# EAGLE design M715 (EAGLE 6.6.0)
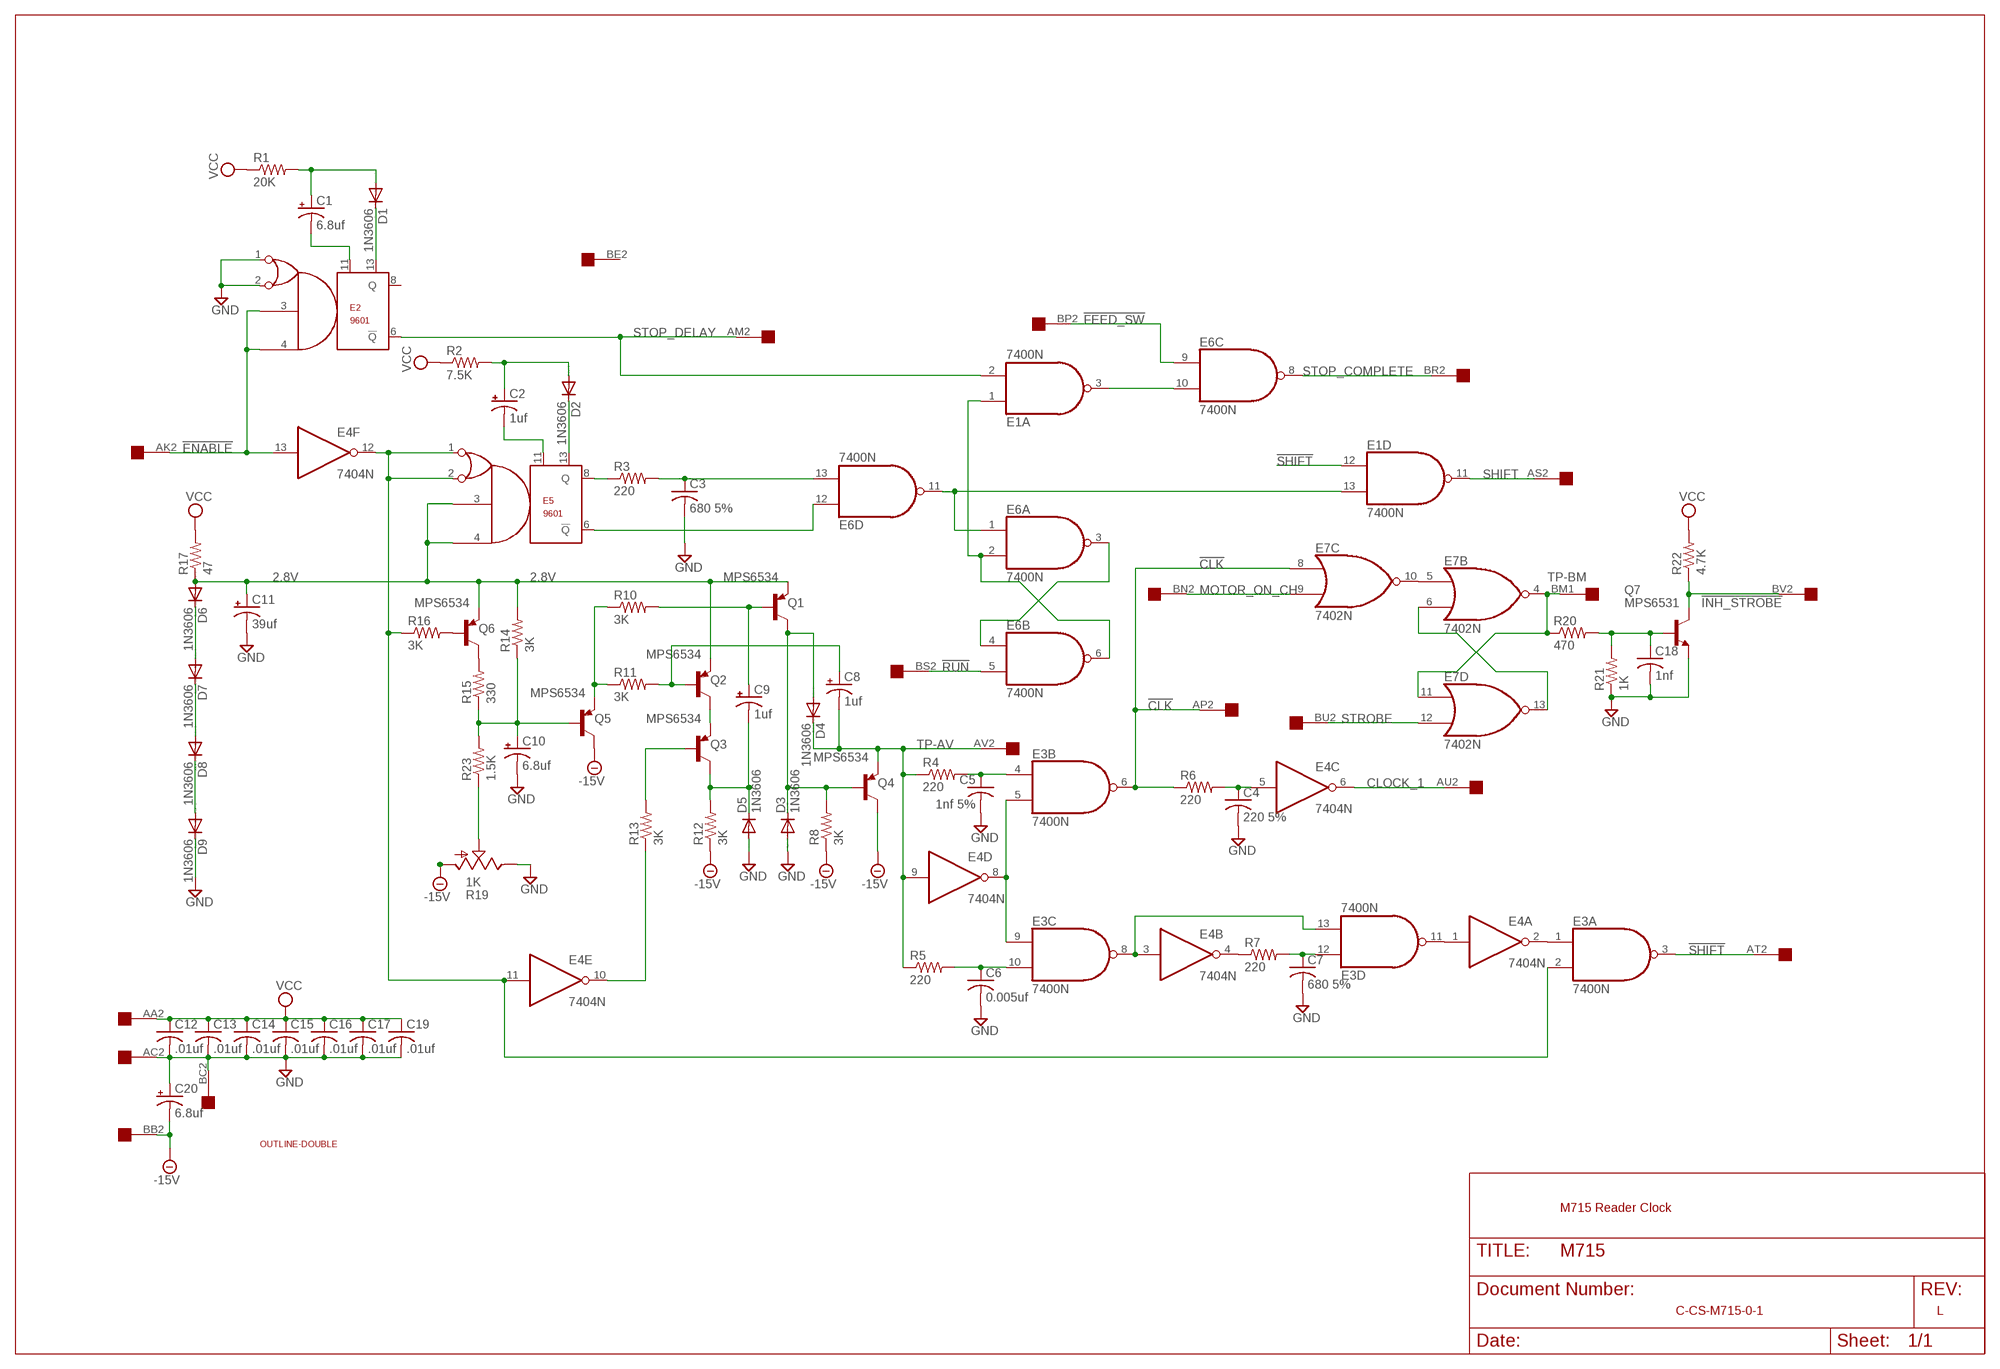
[diagram p0: schematic, sheet 1]

## Parts
C1  6.8uf  CPOL-USE22-6AXIAL  [E22-6]
C2  1uf  CPOL-USE15-5AXIAL  [E15-5]
C3  680 5%  C-US050-025X075  [C050-025X075]
C4  220 5%  C-US050-025X075  [C050-025X075]
C5  1nf 5%  C-US050-025X075  [C050-025X075]
C6  0.005uf  C-US050-025X075  [C050-025X075]
C7  680 5%  C-US050-025X075  [C050-025X075]
C8  1uf  CPOL-USE15-5AXIAL  [E15-5]
C9  1uf  CPOL-USE15-5AXIAL  [E15-5]
C10  6.8uf  CPOL-USE22-6AXIAL  [E22-6]
C11  39uf  CPOL-USE22-6AXIAL  [E22-6]
C12  .01uf  C-US050-025X075  [C050-025X075]
C13  .01uf  C-US050-025X075  [C050-025X075]
C14  .01uf  C-US050-025X075  [C050-025X075]
C15  .01uf  C-US050-025X075  [C050-025X075]
C16  .01uf  C-US050-025X075  [C050-025X075]
C17  .01uf  C-US050-025X075  [C050-025X075]
C18  1nf  C-US050-025X075  [C050-025X075]
C19  .01uf  C-US050-025X075  [C050-025X075]
C20  6.8uf  CPOL-USE22-6AXIAL  [E22-6]
D1  1N3606  1N4148DO35-10  [DO35-10]
D2  1N3606  1N4148DO35-10  [DO35-10]
D3  1N3606  1N4148DO35-10  [DO35-10]
D4  1N3606  1N4148DO35-10  [DO35-10]
D5  1N3606  1N4148DO35-10  [DO35-10]
D6  1N3606  1N4148DO35-10  [DO35-10]
D7  1N3606  1N4148DO35-10  [DO35-10]
D8  1N3606  1N4148DO35-10  [DO35-10]
D9  1N3606  1N4148DO35-10  [DO35-10]
E1  7400N  [DIL14]
E2  9601  [DIL14]
E3  7400N  [DIL14]
E4  7404N  [DIL14]
E5  9601  [DIL14]
E6  7400N  [DIL14]
E7  7402N  [DIL14]
Q1  MPS6534  -PNP-TO92  [TO92]
Q2  MPS6534  -PNP-TO92  [TO92]
Q3  MPS6534  -PNP-TO92  [TO92]
Q4  MPS6534  -PNP-TO92  [TO92]
Q5  MPS6534  -PNP-TO92  [TO92]
Q6  MPS6534  -PNP-TO92  [TO92]
Q7  MPS6531  -NPN-TO92  [TO92]
R1  20K  R-US_0207/10  [0207/10]
R2  7.5K  R-US_0207/10  [0207/10]
R3  220  R-US_0207/10  [0207/10]
R4  220  R-US_0207/10  [0207/10]
R5  220  R-US_0207/10  [0207/10]
R6  220  R-US_0207/10  [0207/10]
R7  220  R-US_0207/10  [0207/10]
R8  3K  R-US_0207/10  [0207/10]
R10  3K  R-US_0207/10  [0207/10]
R11  3K  R-US_0207/10  [0207/10]
R12  3K  R-US_0207/10  [0207/10]
R13  3K  R-US_0207/10  [0207/10]
R14  3K  R-US_0207/10  [0207/10]
R15  330  R-US_0207/10  [0207/10]
R16  3K  R-US_0207/10  [0207/10]
R17  47  R-US_0207/10  [0207/10]
R19  1K  TRIM_US-PTSPIN  [PT-SPIN]
R20  470  R-US_0207/10  [0207/10]
R21  1K  R-US_0207/10  [0207/10]
R22  4.7K  R-US_0207/10  [0207/10]
R23  1.5K  R-US_0207/10  [0207/10]
U$1  DOUBLE  [EDGE-CON4]
U$2  OUTLINE-DOUBLE  [DOUBLE]

## Nets
2.8V: C11.+ D6.A E5.3 E5.4 Q1.1(E) Q2.1(E) Q6.1(E) R14.2 R17.1
!CLK: E3.6(B:O) E7.8(C:I0) R6.1 U$1.AP2
!ENABLE: E2.3 E2.4 E4.13(F:I) U$1.AK2
!FEED_SW: E6.9(C:I0) U$1.BP2
!INH_STROBE: Q7.3(C) R22.1 U$1.BV2
!RUN: E6.5(B:I1) U$1.BS2
!SHIFT: E1.12(D:I0) E3.3(A:O) U$1.AT2
-15V: C20.- Q4.3(C) Q5.3(C) R8.1 R12.1 R19.A U$1.BB2
CLOCK_1: E4.6(C:O) U$1.AU2
GND: C3.2 C4.2 C5.2 C6.2 C7.2 C10.- C11.- C12.2 C13.2 C14.2 C15.2 C16.2 C17.2 C18.2 C19.2 C20.+ D3.A D5.A D9.C E2.1 E2.2 Q7.1(E) R19.E R21.1 U$1.AC2 U$1.BC2
MOTOR_ON_CH: E7.9(C:I1) U$1.BN2
N$1: E6.3(A:O) E6.4(B:I0)
N$2: E1.1(A:I0) E6.2(A:I1) E6.6(B:O)
N$3: E1.13(D:I1) E6.1(A:I0) E6.11(D:O)
N$4: E3.1(A:I0) E4.2(A:O)
N$5: E7.6(B:I1) E7.13(D:O)
N$6: E1.3(A:O) E6.10(C:I1)
N$7: Q6.2(B) R16.2
N$8: E7.5(B:I0) E7.10(C:O)
N$9: E3.2(A:I1) E4.11(E:I) E4.12(F:O) E5.1 E5.2 R16.1
N$10: E3.5(B:I1) E3.9(C:I0) E4.8(D:O)
N$11: E3.11(D:O) E4.1(A:I)
N$12: E3.8(C:O) E3.13(D:I1) E4.3(B:I)
N$13: C7.1 E3.12(D:I0) R7.2
N$14: E4.4(B:O) R7.1
N$15: R19.S R23.1
N$16: C4.1 E4.5(C:I) R6.2
N$17: C18.1 Q7.2(B) R20.2 R21.2
N$18: C6.1 E3.10(C:I1) R5.2
N$19: C5.1 E3.4(B:I0) R4.2
N$20: D6.C D7.A
N$21: D7.C D8.A
N$22: D8.C D9.A
N$23: Q6.3(C) R15.2
N$24: C10.+ Q5.2(B) R14.1 R15.1 R23.2
N$26: Q5.1(E) R10.1 R11.1
N$27: Q2.3(C) Q3.1(E)
N$28: C8.+ Q2.2(B) R11.2
N$29: E4.10(E:O) R13.1
N$30: Q3.2(B) R13.2
N$31: C9.- D5.C Q3.3(C) R12.2
N$32: C9.+ Q1.2(B) R10.2
N$33: D3.C D4.A Q1.3(C) Q4.2(B) R8.2
N$35: D1.C E2.13
N$36: C1.- E2.11
N$37: C1.+ D1.A R1.2
N$38: D2.C E5.13
N$39: C2.- E5.11
N$40: C2.+ D2.A R2.2
N$41: E5.6(!Q) E6.12(D:I0)
N$42: E5.8(Q) R3.1
N$43: C3.1 E6.13(D:I1) R3.2
SHIFT: E1.11(D:O) U$1.AS2
STOP_COMPLETE: E6.8(C:O) U$1.BR2
STOP_DELAY: E1.2(A:I1) E2.6(!Q) U$1.AM2
STROBE: E7.12(D:I1) U$1.BU2
TP-AV: C8.- D4.C E4.9(D:I) Q4.1(E) R4.1 R5.1 U$1.AV2
TP-BM: E7.4(B:O) E7.11(D:I0) R20.1 U$1.BM1
VCC: C12.1 C13.1 C14.1 C15.1 C16.1 C17.1 C19.1 R1.1 R2.1 R17.2 R22.2 U$1.AA2
Unconnected: E1.4(B:I0) E1.5(B:I1) E1.6(B:O) E1.8(C:O) E1.9(C:I0) E1.10(C:I1) E2.8(Q) E7.1(A:O) E7.2(A:I0) E7.3(A:I1) U$1.AA1 U$1.AB1 U$1.AB2 U$1.AC1 U$1.AD1 U$1.AD2 U$1.AE1 U$1.AE2 U$1.AF1 U$1.AF2 U$1.AH1 U$1.AH2 U$1.AJ1 U$1.AJ2 U$1.AK1 U$1.AL1 U$1.AL2 U$1.AM1 U$1.AN1 U$1.AN2 U$1.AP1 U$1.AR1 U$1.AR2 U$1.AS1 U$1.AT1 U$1.AU1 U$1.AV1 U$1.BA1 U$1.BA2 U$1.BB1 U$1.BC1 U$1.BD1 U$1.BD2 U$1.BE1 U$1.BE2 U$1.BF1 U$1.BF2 U$1.BH1 U$1.BH2 U$1.BJ1 U$1.BJ2 U$1.BK1 U$1.BK2 U$1.BL1 U$1.BL2 U$1.BM2 U$1.BN1 U$1.BP1 U$1.BR1 U$1.BS1 U$1.BT1 U$1.BT2 U$1.BU1 U$1.BV1

## Notes on the sheet
- M715 Reader Clock
- C-CS-M715-0-1 | L

## Power pins joined to a net without a drawn wire
GND: E1.7(P:GND) E2.7(GND) E3.7(P:GND) E4.7(P:GND) E5.7(GND) E6.7(P:GND) E7.7(P:GND)
VCC: E1.14(P:VCC) E2.14(VCC) E3.14(P:VCC) E4.14(P:VCC) E5.14(VCC) E6.14(P:VCC) E7.14(P:VCC)

## Library data of the parts
C1 C2 C8-C11 C20 = rcl:CPOL-US: POLARIZED CAPACITOR, American symbol
C3-C7 C12-C19 = rcl:C-US: CAPACITOR, American symbol
D1-D9 = diode:1N4148: DIODE high speed (Philips)
E1 E3 E6 = 74xx-us:74*00: Quad 2-input NAND gate
E2 E5 = dec-con:9601: DEC9601 monstable
E4 = 74xx-us:74*04: Hex INVERTER
E7 = 74xx-us:74*02: Quad 2-input NOR gate
Q1-Q6 = transistor:*-PNP-: PNP Transistror
Q7 = transistor:*-NPN-: NPN Transistror BF959 corrected 2008.03.06
R1-R8 R10-R17 R20-R23 = rcl:R-US_: RESISTOR, American symbol
R19 = pot:TRIM_US-: POTENTIOMETER
U$1 = dec-con:DOUBLE: Double-Height DEC board
U$2 = dec-con:OUTLINE-*: Board outlines for DEC boards.

## Board
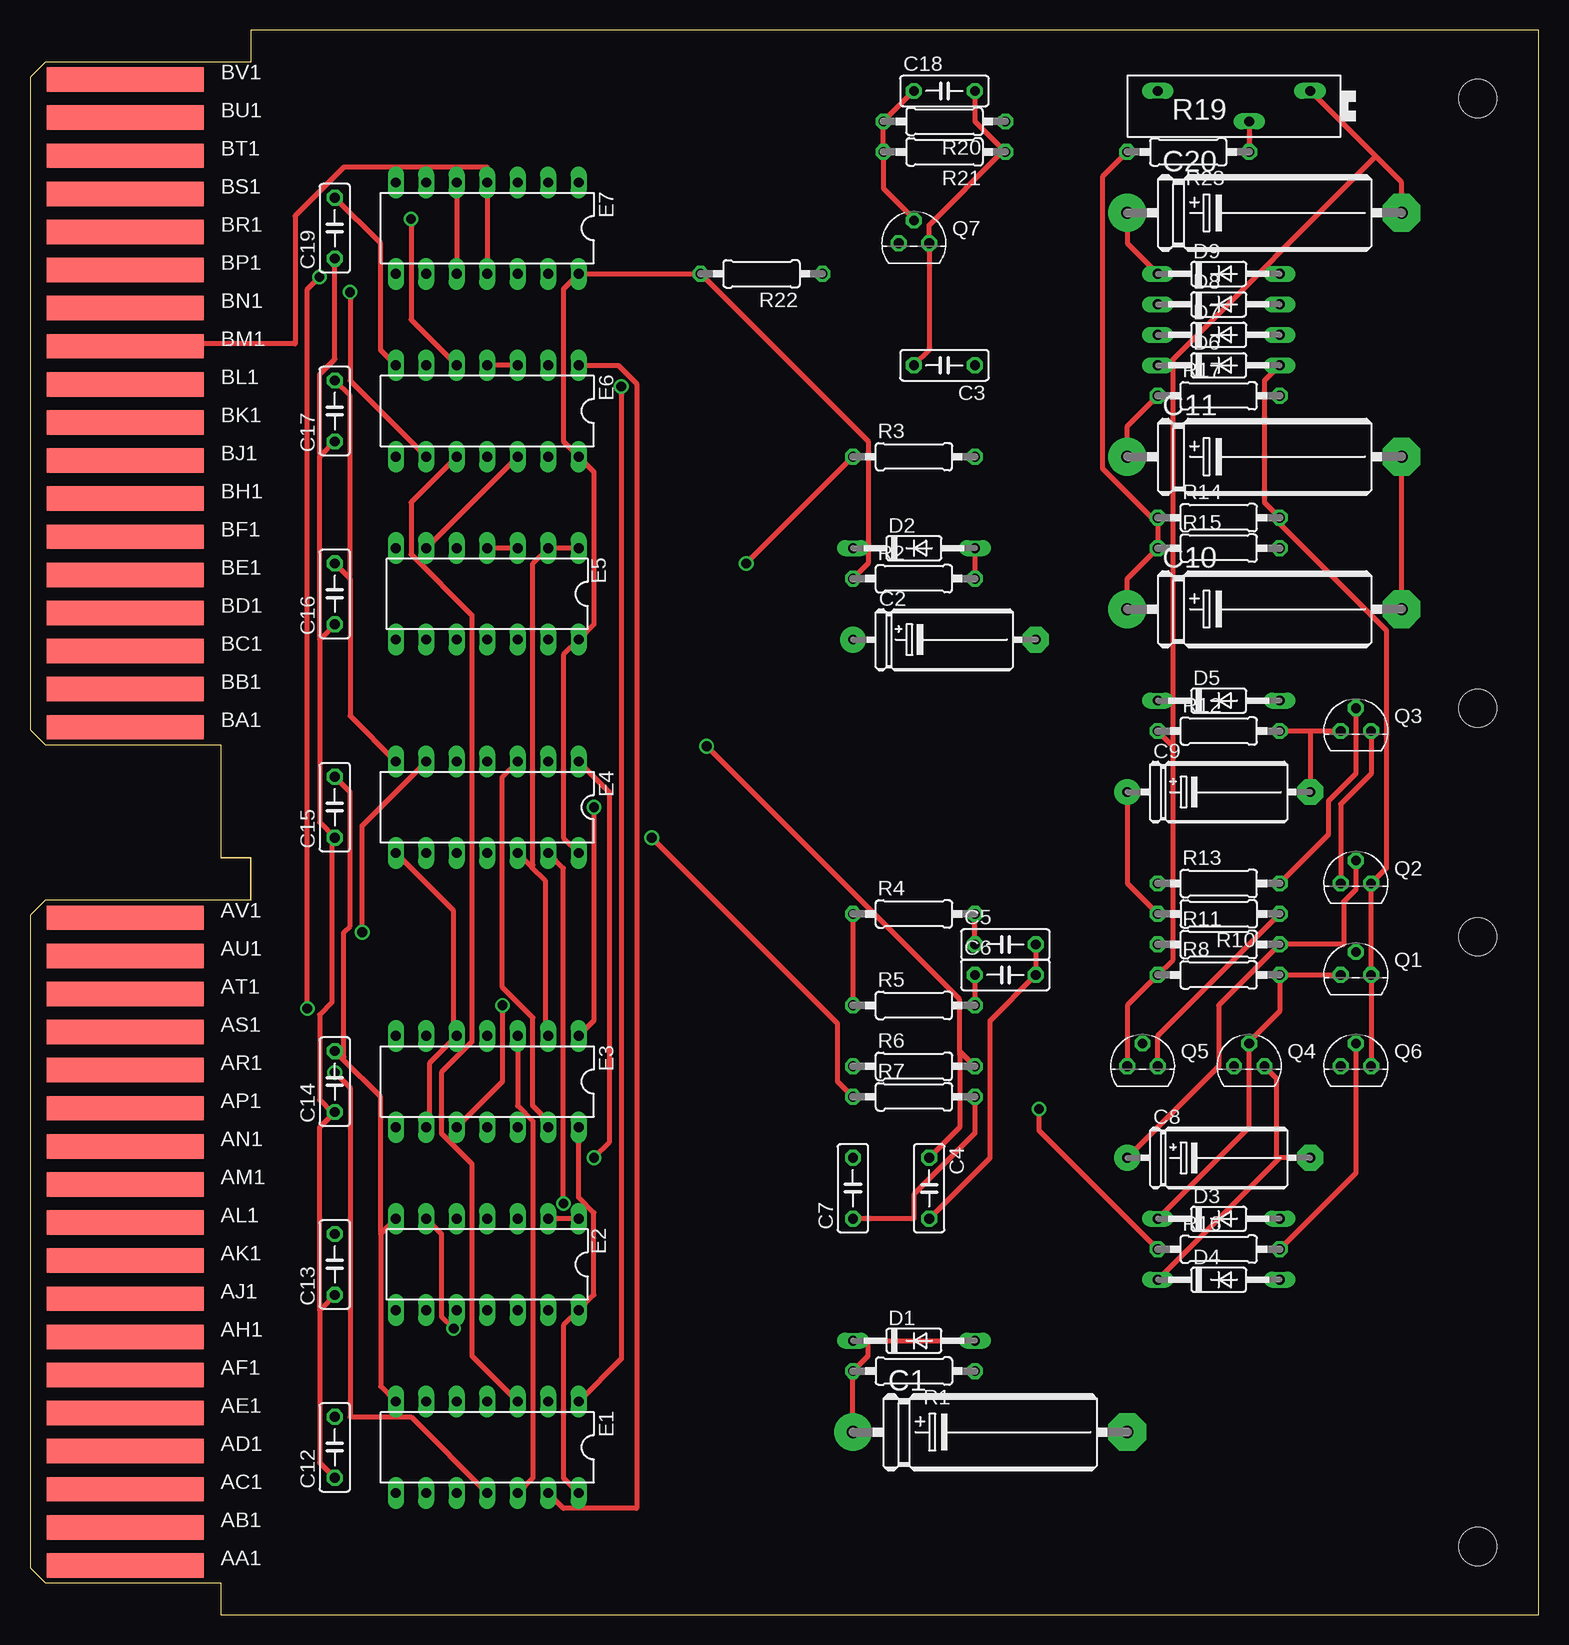
[diagram p1: board, top side]
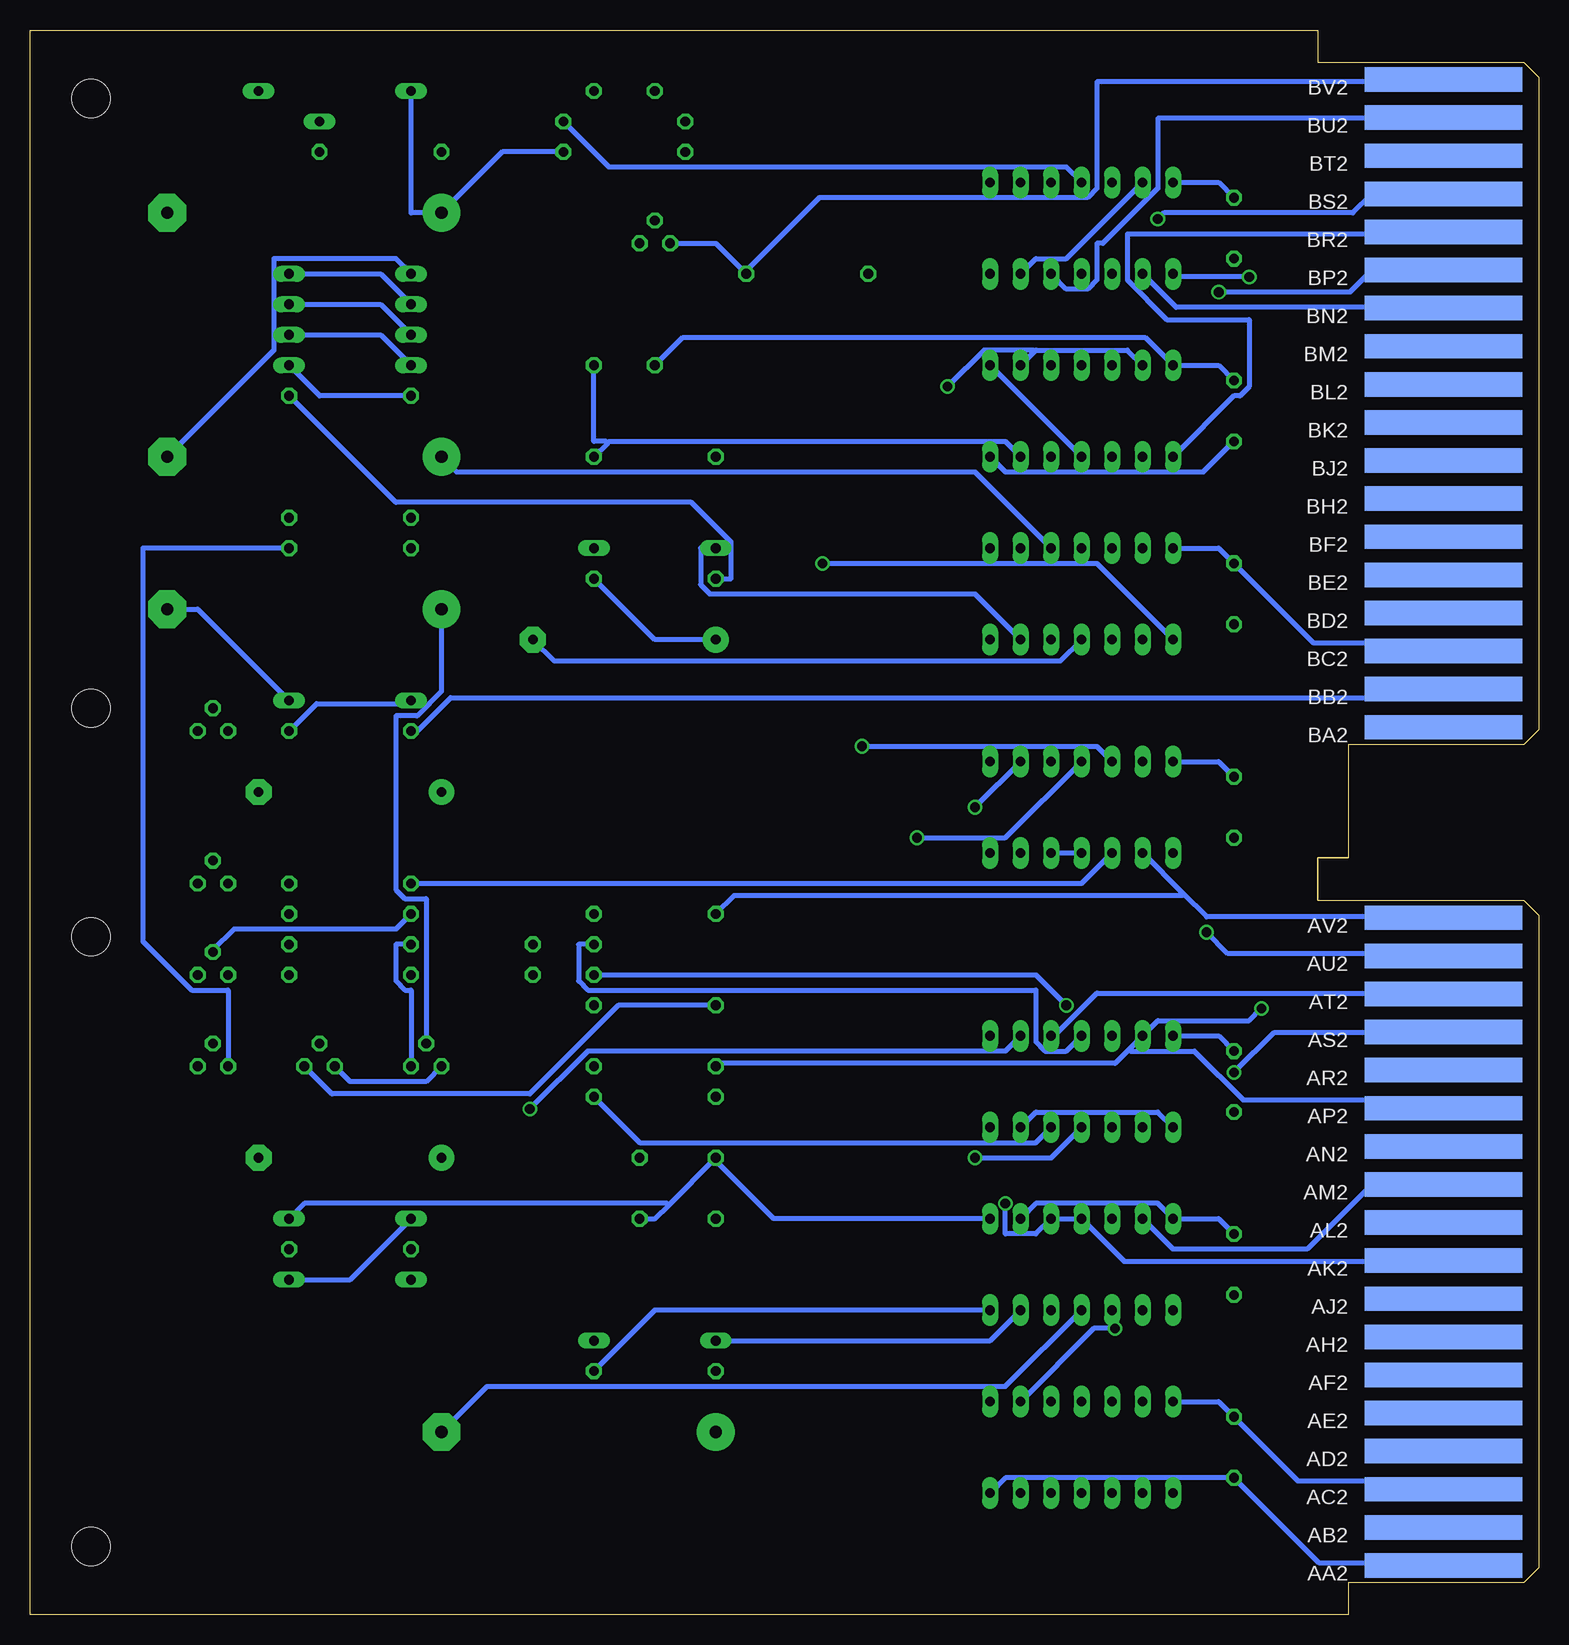
[diagram p2: board, bottom side, seen from below]

Size 125.73 x 132.08 mm. Coordinates in mm from the lower left corner, seen from the top.
Copper layers (1+16): Top 0.035mm / dielectric 1.5mm / Bottom 0.035mm
Design rules "16mils": minimum track width 16mil, minimum drill 32mil, track to track 15mil, track to pad 10mil, pad to pad 10mil, via to via 10mil, smd to smd 10mil, copper to edge 13mil, drill to drill 10mil, minimum pad ring 10mil, minimum via ring 8mil, stop-mask expansion 0mil, vias tented up to drill 0mil, thermal gap 10mil

### Footprints (pad centres in the part's own frame; a part is rotated, then mirrored left to right if it is on the bottom)
E22-6 = drill 1.016 pad 3.15: + -11.43,0 | drill 1.016 pad 3.15 octagon: - 11.43,0
E15-5 = drill 0.813 pad 2.159: + -7.62,0 | drill 0.813 pad 2.159 octagon: - 7.62,0
C050-025X075 = drill 0.813 octagon: 1 -2.54,0; 2 2.54,0
DO35-10 = drill 0.813 long: A 5.08,0; C -5.08,0
DIL14 = drill 0.813 long: 1 -7.62,-3.81; 2 -5.08,-3.81; 3 -2.54,-3.81; 4 0,-3.81; 5 2.54,-3.81; 6 5.08,-3.81; 7 7.62,-3.81; 8 7.62,3.81; 9 5.08,3.81; 10 2.54,3.81; 11 0,3.81; 12 -2.54,3.81; 13 -5.08,3.81; 14 -7.62,3.81
TO92 = drill 0.813 octagon: 1 1.27,0; 2 0,1.905; 3 -1.27,0
0207/10 = drill 0.813 octagon: 1 -5.08,0; 2 5.08,0
PT-SPIN = drill 0.813 long: A -6.35,-1.27; E 6.35,-1.27; S -1.27,1.27
EDGE-CON4 = smd 13.106 x 2.032: AA1 7.938,4.128; AB1 7.938,7.303; AC1 7.938,10.477; AD1 7.938,13.652; AE1 7.938,16.828; AF1 7.938,20.003; AH1 7.938,23.177; AJ1 7.938,26.352; AK1 7.938,29.527; AL1 7.938,32.703; AM1 7.938,35.877; AN1 7.938,39.053; AP1 7.938,42.227; AR1 7.938,45.403; AS1 7.938,48.578; AT1 7.938,51.752; AU1 7.938,54.928; AV1 7.938,58.102; BA1 7.938,73.978; BB1 7.938,77.153; BC1 7.938,80.328; BD1 7.938,83.502; BE1 7.938,86.677; BF1 7.938,89.853; BH1 7.938,93.028; BJ1 7.938,96.203; BK1 7.938,99.377; BL1 7.938,102.552; BM1 7.938,105.728; BN1 7.938,108.903; BP1 7.938,112.078; BR1 7.938,115.252; BS1 7.938,118.427; BT1 7.938,121.603; BU1 7.938,124.778; BV1 7.938,127.953 | smd 13.106 x 2.032 bottom: AA2 7.938,4.128; AB2 7.938,7.303; AC2 7.938,10.477; AD2 7.938,13.652; AE2 7.938,16.828; AF2 7.938,20.003; AH2 7.938,23.177; AJ2 7.938,26.352; AK2 7.938,29.527; AL2 7.938,32.703; AM2 7.938,35.877; AN2 7.938,39.053; AP2 7.938,42.227; AR2 7.938,45.403; AS2 7.938,48.578; AT2 7.938,51.752; AU2 7.938,54.928; AV2 7.938,58.102; BA2 7.938,73.978; BB2 7.938,77.153; BC2 7.938,80.328; BD2 7.938,83.502; BE2 7.938,86.677; BF2 7.938,89.853; BH2 7.938,93.028; BJ2 7.938,96.203; BK2 7.938,99.377; BL2 7.938,102.552; BM2 7.938,105.728; BN2 7.938,108.903; BP2 7.938,112.078; BR2 7.938,115.252; BS2 7.938,118.427; BT2 7.938,121.603; BU2 7.938,124.778; BV2 7.938,127.953
DOUBLE = hole 3.175: 120.65,56.515; 120.65,5.715; 120.65,75.565; 120.65,126.365

### Placement (x,y rotation side)
C1  80.01,15.24 0 top
C2  76.2,81.28 0 top
C3  76.2,104.14 180 top
C4  74.93,35.56 270 top
C5  81.28,55.88 0 top
C6  81.28,53.34 0 top
C7  68.58,35.56 90 top
C8  99.06,38.1 0 top
C9  99.06,68.58 0 top
C10  102.87,83.82 0 top
C11  102.87,96.52 0 top
C12  25.4,13.97 90 top
C13  25.4,29.21 90 top
C14  25.4,44.45 90 top
C15  25.4,67.31 90 top
C16  25.4,85.09 90 top
C17  25.4,100.33 90 top
C18  76.2,127 0 top
C19  25.4,115.57 90 top
C20  102.87,116.84 0 top
D1  73.66,22.86 0 top
D2  73.66,88.9 0 top
D3  99.06,33.02 0 top
D4  99.06,27.94 0 top
D5  99.06,76.2 0 top
D6  99.06,104.14 0 top
D7  99.06,106.68 0 top
D8  99.06,109.22 0 top
D9  99.06,111.76 0 top
E1  38.1,13.97 180 top
E2  38.1,29.21 180 top
E3  38.1,44.45 180 top
E4  38.1,67.31 180 top
E5  38.1,85.09 180 top
E6  38.1,100.33 180 top
E7  38.1,115.57 180 top
Q1  110.49,53.34 0 top
Q2  110.49,60.96 0 top
Q3  110.49,73.66 0 top
Q4  101.6,45.72 0 top
Q5  92.71,45.72 0 top
Q6  110.49,45.72 0 top
Q7  73.66,114.3 0 top
R1  73.66,20.32 180 top
R2  73.66,86.36 0 top
R3  73.66,96.52 0 top
R4  73.66,58.42 0 top
R5  73.66,50.8 0 top
R6  73.66,45.72 0 top
R7  73.66,43.18 0 top
R8  99.06,53.34 0 top
R10  99.06,58.42 180 top
R11  99.06,55.88 0 top
R12  99.06,73.66 0 top
R13  99.06,60.96 0 top
R14  99.06,91.44 0 top
R15  99.06,88.9 0 top
R16  99.06,30.48 0 top
R17  99.06,101.6 0 top
R19  100.33,125.73 180 top
R20  76.2,124.46 180 top
R21  76.2,121.92 180 top
R22  60.96,111.76 180 top
R23  96.52,121.92 180 top
U$1  0,0 0 top
U$2  0,0 0 top

### Tracks (layer width: path | path; a pad name or v marks a point on that pad's centre or on a via)
2.8V
  Top 0.406: Q6.1 Q1.1 Q2.1 113.03,62.23 113.03,82.04 104.14,90.93 R14.2 102.87,92.71 102.87,102.87 D6.A | E5.3 E5.4 | R17.1 91.44,99.06 C11.+
  Bottom 0.406: E5.3 46.99,95.25 90.17,95.25 C11.+ | D6.A 101.6,101.6 R17.1
!CLK  (via drill 0.81)
  Top 0.406: v24.13,111.51 23.11,110.49 v23.11,50.55
  Bottom 0.406: R6.1 68.33,45.97 35.31,45.97 34.16,47.12 | 34.16,47.12 E3.6 31.75,49.53 24.13,49.53 v23.11,50.55 | E7.8 30.23,111.51 v24.13,111.51 | U$1.AP2 8.64,42.93 24.64,42.93 28.7,46.99 34.04,46.99 34.16,47.12
!ENABLE  (via drill 0.81)
  Top 0.406: E4.13 44.45,62.23 v44.45,34.29
  Bottom 0.406: v44.45,34.29 44.45,31.75 41.91,31.75 E2.3 E2.4 34.54,29.46 8.13,29.46 U$1.AK2
!FEED_SW  (via drill 0.81)
  Top 0.406: E6.9 26.67,102.87 v26.67,110.24
  Bottom 0.406: v26.67,110.24 15.75,110.24 13.97,112.01 8.13,112.01 U$1.BP2
!INH_STROBE
  Bottom 0.406: Q7.3 68.58,114.3 R22.1 66.04,112.01 59.94,118.11 37.59,118.11 36.83,118.87 36.83,127.76 8.13,127.76 U$1.BV2
!RUN  (via drill 0.81)
  Top 0.406: E6.5 31.75,107.95 v31.75,116.33
  Bottom 0.406: v31.75,116.33 31.24,116.84 15.49,116.84 13.97,118.36 8.13,118.36 U$1.BS2
!SHIFT
  Top 0.406: E1.12 41.91,11.43 41.91,41.15 40.64,42.42 E3.3
  Bottom 0.406: E3.3 40.39,48.26 36.83,51.82 8.13,51.82 U$1.AT2
-15V
  Top 0.406: 112.14,121.54 114.3,119.38 C20.- | 112.14,121.54 R19.A | Q5.3 91.44,50.8 R8.1 95.25,54.61 95.25,72.39 95.12,72.52 | 95.12,72.52 R12.1 | 112.14,121.54 95.25,104.65 95.25,72.64 95.12,72.52
  Bottom 0.406: Q4.3 99.06,44.45 92.71,44.45 Q5.3 | U$1.BB2 8.64,76.45 90.68,76.45 93.47,73.66 R12.1
CLOCK_1  (via drill 0.81)
  Top 0.406: E4.6 27.69,65.79 v27.69,56.9
  Bottom 0.406: v27.69,56.9 25.91,55.12 8.13,55.12 U$1.AU2
GND
  Top 0.406: C10.- C11.- | D9.C 91.44,114.3 C20.+ | C18.2 78.74,124.46 R21.1 81.03,121.92 74.93,115.82 Q7.1 74.93,105.41 C3.2 | E4.7 26.67,74.93 26.67,86.36 26.54,86.49 | C16.2 26.54,86.49 | C17.2 26.67,101.6 26.67,86.61 26.54,86.49 | C19.2 29.21,114.3 29.21,105.41 E6.7 | C5.2 C6.2 80.01,49.53 80.01,38.1 C4.2 | E2.1 E2.2 | E1.7 29.21,19.05 29.21,31.75 29.34,31.88 | E2.7 29.34,31.88 | 26.04,46.35 29.21,43.18 29.21,32 29.34,31.88 | 26.04,46.35 C14.2 | C15.2 26.67,68.58 26.67,57.4 26.16,56.9 26.16,46.48 26.04,46.35
  Bottom 0.406: D5.A 111.76,83.82 C10.- | R19.E 93.98,116.84 C20.+ 86.36,121.92 R21.1 | C11.- 105.41,105.41 105.41,113.03 95.25,113.03 D9.C | C19.2 26.67,119.38 E7.7 | C17.2 26.67,104.14 E6.7 32.77,106.43 71.37,106.43 C3.2 | C15.2 26.67,71.12 E4.7 | E5.7 26.67,88.9 C16.2 18.8,81.03 8.64,81.03 U$1.BC2 | 72.52,34.16 73.66,33.02 C4.2 | 72.52,34.16 C7.2 68.58,37.85 63.75,33.02 E2.1 | D3.A 102.87,34.29 72.64,34.29 72.52,34.16 | C14.2 26.67,48.26 E3.7 | E1.7 26.67,17.78 C12.2 20.07,11.18 8.64,11.18 U$1.AC2 | C13.2 26.67,33.02 E2.7 31.75,34.29 41.91,34.29 E2.2
MOTOR_ON_CH
  Bottom 0.406: E7.9 30.23,108.97 8.13,108.97 U$1.BN2
N$1
  Top 0.406: E6.3 E6.4
N$2  (via drill 0.81)
  Top 0.406: E1.1 49.28,21.34 v49.28,102.36
  Bottom 0.406: E6.6 34.29,105.41 41.91,105.41 42.04,105.28 | E6.2 42.04,105.28 | v49.28,102.36 46.23,105.41 42.16,105.41 42.04,105.28
N$3
  Top 0.406: E1.13 44.45,8.89 50.55,8.89 50.55,102.62 49.02,104.14 E6.1
  Bottom 0.406: E6.1 E6.11
N$4  (via drill 0.81)
  Top 0.406: E3.1 46.99,49.53 v46.99,67.31
  Bottom 0.406: E4.2 v46.99,67.31
N$5
  Bottom 0.406: E7.6 39.37,113.03 41.91,113.03 E7.13
N$6
  Top 0.406: E1.3 36.83,21.59 36.83,37.59 34.29,40.13 34.29,45.21 36.83,47.75 36.83,83.31 31.75,88.39 31.75,92.71 E6.10
N$7
  Top 0.406: R16.2 110.49,36.83 Q6.2
N$8
  Top 0.406: E7.5 E7.10
N$9  (via drill 0.81)
  Top 0.406: E5.1 E5.2 41.91,87.63 41.91,62.48 41.78,62.36 | E3.2 42.93,48.51 42.93,61.21 41.78,62.36 | E4.12 41.78,62.36 | R16.1 84.07,40.39 v84.07,42.16
  Bottom 0.406: E4.12 E4.11 | v84.07,42.16 79.25,46.99 44.45,46.99 E3.2
N$10
  Top 0.406: E3.9 33.27,40.89 33.27,45.97 E3.5 35.31,48.26 35.31,58.67 E4.8
N$11  (via drill 0.81)
  Top 0.406: v46.99,38.1 48.26,39.37 48.26,68.58 E4.1
  Bottom 0.406: E3.11 40.64,38.1 v46.99,38.1
N$12
  Top 0.406: E4.3 39.37,69.85 39.37,52.32 41.91,49.78 41.91,42.42 43.18,41.15 E3.13
  Bottom 0.406: E3.8 31.75,41.91 41.91,41.91 E3.13
N$13
  Top 0.406: C7.1 73.66,33.02 73.66,35.05 78.74,40.13 R7.2
  Bottom 0.406: E3.12 41.91,39.37 74.93,39.37 R7.2
N$14  (via drill 0.81)
  Top 0.406: v51.82,64.77 67.31,49.28 67.31,44.45 R7.1
  Bottom 0.406: E4.4 44.45,64.77 v51.82,64.77
N$15
  Top 0.406: R19.S R23.1
N$16  (via drill 0.81)
  Top 0.406: v56.39,72.39 77.47,51.31 77.47,46.99 77.6,46.86 | R6.2 77.6,46.86 | C4.1 77.47,40.64 77.47,46.74 77.6,46.86
  Bottom 0.406: E4.5 36.83,72.39 v56.39,72.39
N$17
  Top 0.406: Q7.2 73.66,116.33 71.12,118.87 R21.2 R20.2 C18.1
N$18  (via drill 0.81)
  Top 0.406: E3.10 39.37,44.45 v39.37,50.8 | C6.1 R5.2
  Bottom 0.406: v39.37,50.8 41.91,53.34 C6.1
N$19
  Top 0.406: C5.1 R4.2
  Bottom 0.406: E3.4 39.37,46.99 41.15,46.99 41.91,47.75 41.91,52.07 79.25,52.07 80.01,52.83 80.01,55.88 C5.1
N$20
  Bottom 0.406: D6.C 96.52,106.68 D7.A
N$21
  Bottom 0.406: D7.C 96.52,109.22 D8.A
N$22
  Bottom 0.406: D8.C 96.52,111.76 D9.A
N$23
  Bottom 0.406: Q6.3 109.22,52.07 112.27,52.07 116.33,56.13 116.33,88.9 R15.2
N$24
  Top 0.406: 93.98,90.93 R15.1 91.44,86.36 C10.+ | R23.2 89.41,119.89 89.41,95.5 93.98,90.93 | 93.98,90.93 R14.1
  Bottom 0.406: Q5.2 92.71,59.69 94.49,59.69 95.25,60.45 95.25,74.93 93.47,74.93 91.44,76.96 C10.+
N$26
  Top 0.406: R10.1 93.98,48.26 Q5.1
  Bottom 0.406: Q5.1 93.98,52.07 94.49,52.07 95.25,52.83 95.25,55.88 R11.1
N$27
  Top 0.406: Q2.3 109.22,67.56 111.76,70.1 Q3.1
N$28
  Top 0.406: Q2.2 110.49,60.45 109.47,59.44 109.47,55.88 R11.2 99.06,50.8 99.06,45.72 C8.+
N$29
  Bottom 0.406: E4.10 38.1,60.96 R13.1
N$30
  Top 0.406: R13.2 108.2,65.02 108.2,67.82 110.49,70.1 Q3.2
N$31
  Top 0.406: Q3.3 106.68,73.66 | 106.68,73.66 R12.2 | 106.68,73.66 C9.-
  Bottom 0.406: D5.C 94.23,75.95 101.85,75.95 R12.2
N$32
  Top 0.406: R10.2 91.44,60.96 C9.+
  Bottom 0.406: R10.2 95.25,57.15 108.71,57.15 110.49,55.37 Q1.2
N$33
  Top 0.406: Q1.3 R8.2 104.14,50.29 101.6,47.75 Q4.2 101.6,40.64 D3.C
  Bottom 0.406: D3.C 99.06,27.94 D4.A
N$35
  Bottom 0.406: E2.13 45.72,22.86 D1.C
N$36
  Bottom 0.406: E2.11 44.45,19.05 87.63,19.05 C1.-
N$37
  Top 0.406: C1.+ R1.2 69.85,21.59 69.85,22.86 D1.A
N$38
  Bottom 0.406: E5.13 46.99,85.09 69.09,85.09 69.85,85.85 69.85,88.9 D2.C
N$39
  Bottom 0.406: E5.11 39.88,79.5 82.04,79.5 C2.-
N$40
  Top 0.406: D2.A R2.2
  Bottom 0.406: R2.2 73.66,81.28 C2.+
N$41
  Top 0.406: E6.12 E5.6
N$42  (via drill 0.81)
  Top 0.406: R3.1 v59.69,87.63
  Bottom 0.406: E5.8 36.83,87.63 v59.69,87.63
N$43
  Bottom 0.406: E6.13 44.45,97.79 77.47,97.79 77.6,97.66 | R3.2 77.6,97.66 | C3.1 78.74,97.79 77.72,97.79 77.6,97.66
SHIFT  (via drill 0.81)
  Top 0.406: E1.11 31.75,16.51 26.67,16.51 26.67,43.94 v25.4,45.21
  Bottom 0.406: v25.4,45.21 22.1,48.51 8.13,48.51 U$1.AS2
STOP_COMPLETE
  Bottom 0.406: E6.8 25.4,101.6 24.89,101.6 24.13,102.36 24.13,107.95 30.99,107.95 34.29,111.25 34.29,115.06 8.13,115.06 U$1.BR2
STOP_DELAY  (via drill 0.81)
  Top 0.406: v35.31,23.88 34.29,24.89 34.29,31.75 E2.6
  Bottom 0.406: E1.2 37.08,23.88 v35.31,23.88 | E2.6 30.48,30.48 19.3,30.48 13.97,35.81 8.13,35.81 U$1.AM2
STROBE
  Bottom 0.406: E7.12 39.37,110.49 37.59,110.49 36.83,111.25 36.83,114.3 36.32,114.3 31.75,118.87 31.75,124.71 8.13,124.71 U$1.BU2
TP-AV
  Top 0.406: 104.01,37.97 104.14,38.1 C8.- | 104.01,37.97 D4.C | Q4.1 103.89,44.7 103.89,38.1 104.01,37.97 | R4.1 R5.1
  Bottom 0.406: 29.59,60.07 27.69,58.17 8.13,58.17 U$1.AV2 | 29.59,60.07 E4.9 | R4.1 67.06,59.94 29.72,59.94 29.59,60.07 | Q4.1 100.58,43.43 84.07,43.43 76.71,50.8 R5.1
TP-BM
  Top 0.406: E7.11 E7.4 38.1,120.65 26.16,120.65 22.1,116.59 22.1,105.92 8.13,105.92 U$1.BM1
  Bottom 0.406: R20.1 77.47,120.65 39.37,120.65 E7.4
VCC
  Top 0.406: E1.14 44.45,11.43 44.45,24.13 E2.14 46.99,26.67 46.99,33.53 45.72,34.8 E3.14 | C12.1 24.13,12.7 24.13,25.4 24.26,25.53 | C13.1 24.26,25.53 | 24.26,25.53 24.13,25.65 24.13,40.64 C14.1 25.15,41.91 24.13,42.93 24.13,50.04 25.15,51.05 25.15,64.77 C15.1 24.13,66.04 24.13,81.28 24.26,81.41 | C16.1 24.26,81.41 | 24.26,96.65 24.13,96.52 24.13,81.53 24.26,81.41 | 24.26,96.65 C17.1 | C19.1 25.4,104.65 24.13,103.38 24.13,96.77 24.26,96.65 | E4.14 44.45,64.77 44.45,80.01 E5.14 46.99,82.55 46.99,95.25 E6.14 44.45,97.79 44.45,110.49 E7.14 R22.2 69.85,97.79 69.85,87.63 R2.1
  Bottom 0.406: R1.1 73.66,25.4 E2.14 | U$1.AA2 8.13,4.32 18.29,4.32 C12.1 44.45,11.43 E1.14 | R17.2 95.25,92.71 70.61,92.71 67.31,89.41 67.31,86.36 R2.1 | C17.1 27.94,95.25 44.45,95.25 E6.14